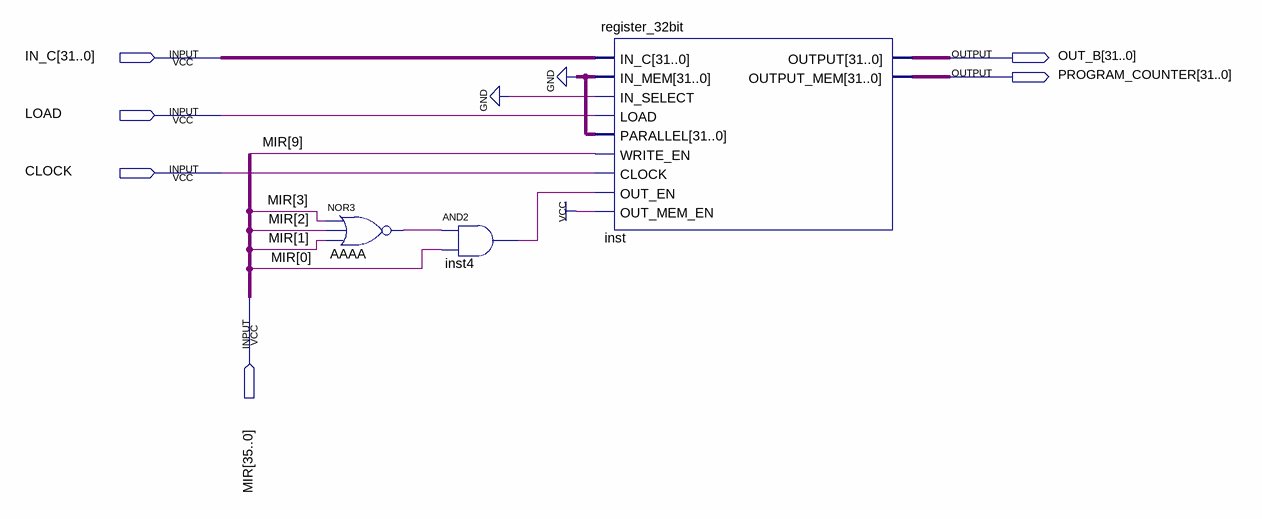
[diagram p0: schematic sheet]
// Quartus schematic PC.bdf as structural Verilog: 3 symbols, 6 pins
module PC (
  input  [31:0] IN_C,
  input  LOAD,
  input  CLOCK,
  input  [35:0] MIR,
  output [31:0] OUT_B,
  output [31:0] PROGRAM_COUNTER
);

  wire AAAA_out, inst4_out;

  nor AAAA (AAAA_out, MIR[3], MIR[2], MIR[1]);
  and inst4 (inst4_out, AAAA_out, MIR[0]);
  register_32bit inst (
    .IN_C(IN_C), .IN_MEM({32{1'b0}}), .IN_SELECT(1'b0), .LOAD(LOAD), .PARALLEL({32{1'b0}}),
    .WRITE_EN(MIR[9]), .CLOCK(CLOCK), .OUT_EN(inst4_out), .OUT_MEM_EN(1'b1), .OUTPUT(OUT_B),
    .OUTPUT_MEM(PROGRAM_COUNTER));
endmodule
